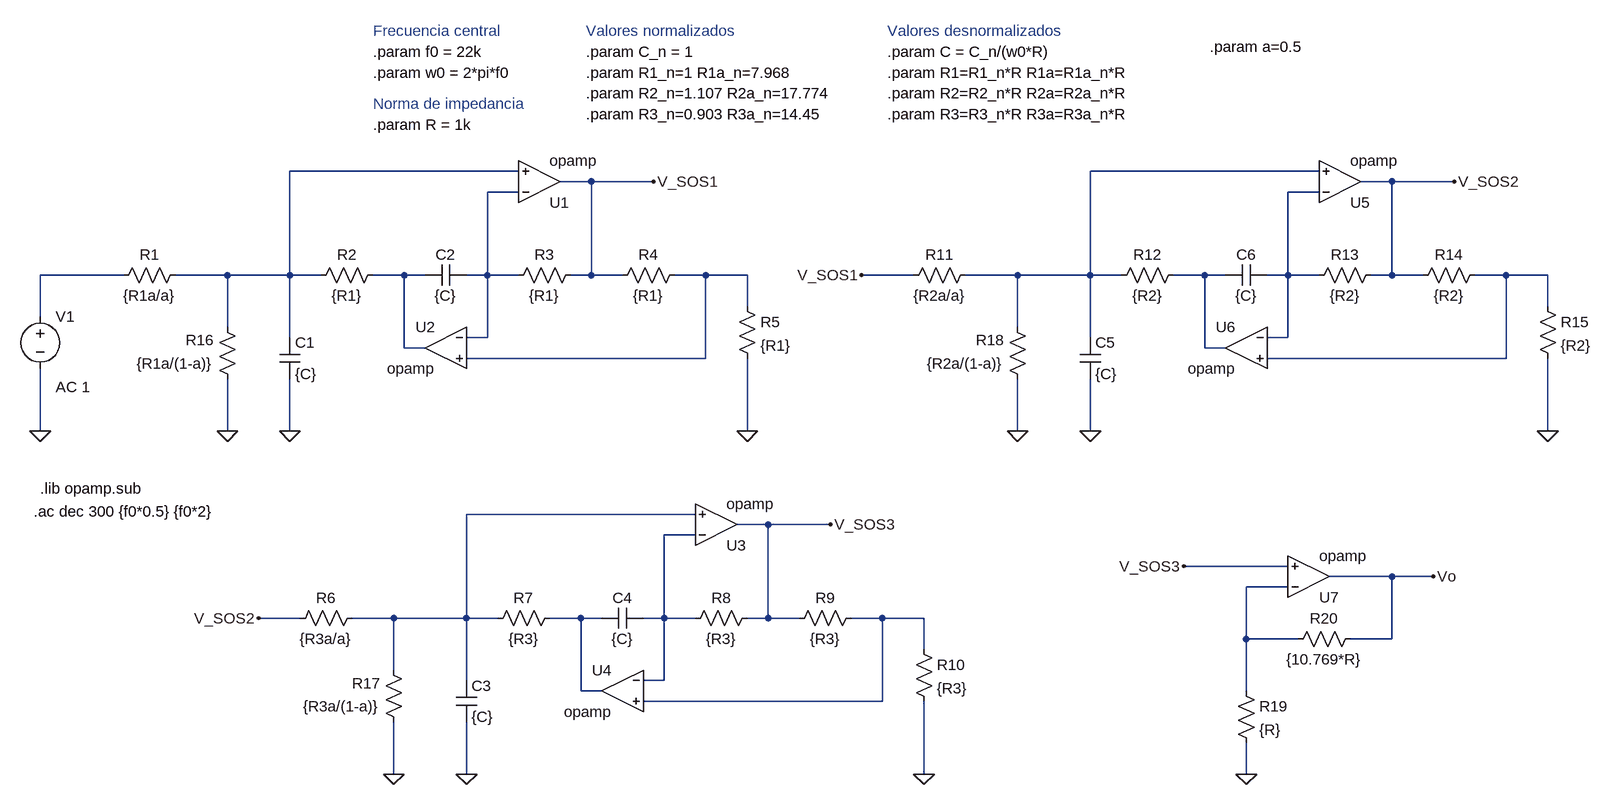
[diagram p0: schematic TS2_Activa.asc]
TS2_Activa.asc, the LTspice schematic file:
Version 4
SHEET 1 2452 1180
WIRE 224 0 -128 0
WIRE 1456 0 1104 0
WIRE 336 16 288 16
WIRE 432 16 336 16
WIRE 1568 16 1520 16
WIRE 1664 16 1568 16
WIRE 224 32 176 32
WIRE 1456 32 1408 32
WIRE -384 160 -512 160
WIRE -224 160 -304 160
WIRE -128 160 -128 0
WIRE -128 160 -224 160
WIRE -80 160 -128 160
WIRE 48 160 0 160
WIRE 80 160 48 160
WIRE 176 160 176 32
WIRE 176 160 144 160
WIRE 224 160 176 160
WIRE 336 160 336 16
WIRE 336 160 304 160
WIRE 384 160 336 160
WIRE 512 160 464 160
WIRE 576 160 512 160
WIRE 832 160 752 160
WIRE 992 160 912 160
WIRE 1104 160 1104 0
WIRE 1104 160 992 160
WIRE 1152 160 1104 160
WIRE 1280 160 1232 160
WIRE 1312 160 1280 160
WIRE 1408 160 1408 32
WIRE 1408 160 1376 160
WIRE 1456 160 1408 160
WIRE 1568 160 1568 16
WIRE 1568 160 1536 160
WIRE 1616 160 1568 160
WIRE 1744 160 1696 160
WIRE 1808 160 1744 160
WIRE 576 208 576 160
WIRE 1808 208 1808 160
WIRE -512 224 -512 160
WIRE -224 240 -224 160
WIRE 992 240 992 160
WIRE -128 256 -128 160
WIRE 176 256 176 160
WIRE 176 256 144 256
WIRE 1104 256 1104 160
WIRE 1408 256 1408 160
WIRE 1408 256 1376 256
WIRE 48 272 48 160
WIRE 80 272 48 272
WIRE 1280 272 1280 160
WIRE 1312 272 1280 272
WIRE 512 288 512 160
WIRE 512 288 144 288
WIRE 1744 288 1744 160
WIRE 1744 288 1376 288
WIRE -512 400 -512 304
WIRE -224 400 -224 320
WIRE -128 400 -128 320
WIRE 576 400 576 288
WIRE 992 400 992 320
WIRE 1104 400 1104 320
WIRE 1808 400 1808 288
WIRE 496 528 144 528
WIRE 608 544 560 544
WIRE 704 544 608 544
WIRE 496 560 448 560
WIRE 1408 608 1248 608
WIRE 1568 624 1472 624
WIRE 1632 624 1568 624
WIRE 1408 640 1344 640
WIRE -112 688 -176 688
WIRE 32 688 -32 688
WIRE 144 688 144 528
WIRE 144 688 32 688
WIRE 192 688 144 688
WIRE 320 688 272 688
WIRE 352 688 320 688
WIRE 448 688 448 560
WIRE 448 688 416 688
WIRE 496 688 448 688
WIRE 608 688 608 544
WIRE 608 688 576 688
WIRE 656 688 608 688
WIRE 784 688 736 688
WIRE 848 688 784 688
WIRE 1344 720 1344 640
WIRE 1424 720 1344 720
WIRE 1568 720 1568 624
WIRE 1568 720 1504 720
WIRE 848 736 848 688
WIRE 32 768 32 688
WIRE 144 784 144 688
WIRE 448 784 448 688
WIRE 448 784 416 784
WIRE 320 800 320 688
WIRE 352 800 320 800
WIRE 1344 800 1344 720
WIRE 784 816 784 688
WIRE 784 816 416 816
WIRE 32 928 32 848
WIRE 144 928 144 848
WIRE 848 928 848 816
WIRE 1344 928 1344 880
FLAG -512 400 0
FLAG 576 400 0
FLAG -128 400 0
FLAG 432 16 V_SOS1
FLAG 848 928 0
FLAG 144 928 0
FLAG 704 544 V_SOS3
FLAG 1808 400 0
FLAG 1104 400 0
FLAG 1664 16 V_SOS2
FLAG 752 160 V_SOS1
FLAG -176 688 V_SOS2
FLAG 32 928 0
FLAG 992 400 0
FLAG -224 400 0
FLAG 1344 928 0
FLAG 1248 608 V_SOS3
FLAG 1632 624 Vo
SYMBOL res -288 144 R90
WINDOW 0 0 56 VBottom 2
WINDOW 3 32 56 VTop 2
SYMATTR InstName R1
SYMATTR Value {R1a/a}
SYMBOL cap -144 256 R0
SYMATTR InstName C1
SYMATTR Value {C}
SYMBOL voltage -512 208 R0
WINDOW 123 24 124 Left 2
WINDOW 39 0 0 Left 0
SYMATTR InstName V1
SYMATTR Value ""
SYMATTR Value2 AC 1
SYMBOL OpAmps\\opamp 256 80 M180
SYMATTR InstName U1
SYMBOL OpAmps\\opamp 112 208 M0
SYMATTR InstName U2
SYMBOL res 16 144 R90
WINDOW 0 0 56 VBottom 2
WINDOW 3 32 56 VTop 2
SYMATTR InstName R2
SYMATTR Value {R1}
SYMBOL cap 144 144 R90
WINDOW 0 0 32 VBottom 2
WINDOW 3 32 32 VTop 2
SYMATTR InstName C2
SYMATTR Value {C}
SYMBOL res 320 144 R90
WINDOW 0 0 56 VBottom 2
WINDOW 3 32 56 VTop 2
SYMATTR InstName R3
SYMATTR Value {R1}
SYMBOL res 480 144 R90
WINDOW 0 0 56 VBottom 2
WINDOW 3 32 56 VTop 2
SYMATTR InstName R4
SYMATTR Value {R1}
SYMBOL res 560 192 R0
SYMATTR InstName R5
SYMATTR Value {R1}
SYMBOL res -16 672 R90
WINDOW 0 0 56 VBottom 2
WINDOW 3 32 56 VTop 2
SYMATTR InstName R6
SYMATTR Value {R3a/a}
SYMBOL cap 128 784 R0
SYMATTR InstName C3
SYMATTR Value {C}
SYMBOL OpAmps\\opamp 528 608 M180
SYMATTR InstName U3
SYMBOL OpAmps\\opamp 384 736 M0
SYMATTR InstName U4
SYMBOL res 288 672 R90
WINDOW 0 0 56 VBottom 2
WINDOW 3 32 56 VTop 2
SYMATTR InstName R7
SYMATTR Value {R3}
SYMBOL cap 416 672 R90
WINDOW 0 0 32 VBottom 2
WINDOW 3 32 32 VTop 2
SYMATTR InstName C4
SYMATTR Value {C}
SYMBOL res 592 672 R90
WINDOW 0 0 56 VBottom 2
WINDOW 3 32 56 VTop 2
SYMATTR InstName R8
SYMATTR Value {R3}
SYMBOL res 752 672 R90
WINDOW 0 0 56 VBottom 2
WINDOW 3 32 56 VTop 2
SYMATTR InstName R9
SYMATTR Value {R3}
SYMBOL res 832 720 R0
SYMATTR InstName R10
SYMATTR Value {R3}
SYMBOL res 928 144 R90
WINDOW 0 0 56 VBottom 2
WINDOW 3 32 56 VTop 2
SYMATTR InstName R11
SYMATTR Value {R2a/a}
SYMBOL cap 1088 256 R0
SYMATTR InstName C5
SYMATTR Value {C}
SYMBOL OpAmps\\opamp 1488 80 M180
SYMATTR InstName U5
SYMBOL OpAmps\\opamp 1344 208 M0
SYMATTR InstName U6
SYMBOL res 1248 144 R90
WINDOW 0 0 56 VBottom 2
WINDOW 3 32 56 VTop 2
SYMATTR InstName R12
SYMATTR Value {R2}
SYMBOL cap 1376 144 R90
WINDOW 0 0 32 VBottom 2
WINDOW 3 32 32 VTop 2
SYMATTR InstName C6
SYMATTR Value {C}
SYMBOL res 1552 144 R90
WINDOW 0 0 56 VBottom 2
WINDOW 3 32 56 VTop 2
SYMATTR InstName R13
SYMATTR Value {R2}
SYMBOL res 1712 144 R90
WINDOW 0 0 56 VBottom 2
WINDOW 3 32 56 VTop 2
SYMATTR InstName R14
SYMATTR Value {R2}
SYMBOL res 1792 192 R0
SYMATTR InstName R15
SYMATTR Value {R2}
SYMBOL res 48 864 R180
WINDOW 0 36 76 Left 2
WINDOW 3 36 40 Left 2
SYMATTR InstName R17
SYMATTR Value {R3a/(1-a)}
SYMBOL res -208 336 R180
WINDOW 0 36 76 Left 2
WINDOW 3 36 40 Left 2
SYMATTR InstName R16
SYMATTR Value {R1a/(1-a)}
SYMBOL res 1008 336 R180
WINDOW 0 36 76 Left 2
WINDOW 3 36 40 Left 2
SYMATTR InstName R18
SYMATTR Value {R2a/(1-a)}
SYMBOL OpAmps\\opamp 1440 688 M180
SYMATTR InstName U7
SYMBOL res 1328 784 R0
SYMATTR InstName R19
SYMATTR Value {R}
SYMBOL res 1520 704 R90
WINDOW 0 0 56 VBottom 2
WINDOW 3 32 56 VTop 2
SYMATTR InstName R20
SYMATTR Value {10.769*R}
TEXT 0 -216 Left 2 ;Frecuencia central
TEXT 0 -184 Left 2 !.param f0 = 22k
TEXT 0 -72 Left 2 !.param R = 1k
TEXT 0 -104 Left 2 ;Norma de impedancia
TEXT 0 -152 Left 2 !.param w0 = 2*pi*f0
TEXT 328 -216 Left 2 ;Valores normalizados
TEXT 328 -184 Left 2 !.param C_n = 1
TEXT 792 -216 Left 2 ;Valores desnormalizados
TEXT 792 -184 Left 2 !.param C = C_n/(w0*R)
TEXT -522 524 Left 2 !.ac dec 300 {f0*0.5} {f0*2}
TEXT 328 -152 Left 2 !.param R1_n=1 R1a_n=7.968
TEXT 328 -120 Left 2 !.param R2_n=1.107 R2a_n=17.774
TEXT 328 -88 Left 2 !.param R3_n=0.903 R3a_n=14.45
TEXT 792 -152 Left 2 !.param R1=R1_n*R R1a=R1a_n*R
TEXT 792 -120 Left 2 !.param R2=R2_n*R R2a=R2a_n*R
TEXT 792 -88 Left 2 !.param R3=R3_n*R R3a=R3a_n*R
TEXT -512 488 Left 2 !.lib opamp.sub
TEXT 1288 -192 Left 2 !.param a=0.5

The netlist it stands for:
* TS2_Activa.asc
R1 N001 N005 {R1a/a}
C1 N001 0 {C}
V1 N005 0 AC 1
XU1 N003 N001 V_SOS1 opamp Aol=100K GBW=10Meg  ; pins invin noninvin out
XU2 N003 N007 N006 opamp Aol=100K GBW=10Meg  ; pins invin noninvin out
R2 N006 N001 {R1}
C2 N003 N006 {C}
R3 V_SOS1 N003 {R1}
R4 N007 V_SOS1 {R1}
R5 N007 0 {R1}
R6 N010 V_SOS2 {R3a/a}
C3 N010 0 {C}
XU3 N011 N010 V_SOS3 opamp Aol=100K GBW=10Meg  ; pins invin noninvin out
XU4 N011 N014 N013 opamp Aol=100K GBW=10Meg  ; pins invin noninvin out
R7 N013 N010 {R3}
C4 N011 N013 {C}
R8 V_SOS3 N011 {R3}
R9 N014 V_SOS3 {R3}
R10 N014 0 {R3}
R11 N002 V_SOS1 {R2a/a}
C5 N002 0 {C}
XU5 N004 N002 V_SOS2 opamp Aol=100K GBW=10Meg  ; pins invin noninvin out
XU6 N004 N009 N008 opamp Aol=100K GBW=10Meg  ; pins invin noninvin out
R12 N008 N002 {R2}
C6 N004 N008 {C}
R13 V_SOS2 N004 {R2}
R14 N009 V_SOS2 {R2}
R15 N009 0 {R2}
R17 0 N010 {R3a/(1-a)}
R16 0 N001 {R1a/(1-a)}
R18 0 N002 {R2a/(1-a)}
XU7 N012 V_SOS3 Vo opamp Aol=100K GBW=10Meg  ; pins invin noninvin out
R19 N012 0 {R}
R20 Vo N012 {10.769*R}
* Frecuencia central
.param f0 = 22k
.param R = 1k
* Norma de impedancia
.param w0 = 2*pi*f0
* Valores normalizados
.param C_n = 1
* Valores desnormalizados
.param C = C_n/(w0*R)
.ac dec 300 {f0*0.5} {f0*2}
.param R1_n=1 R1a_n=7.968
.param R2_n=1.107 R2a_n=17.774
.param R3_n=0.903 R3a_n=14.45
.param R1=R1_n*R R1a=R1a_n*R
.param R2=R2_n*R R2a=R2a_n*R
.param R3=R3_n*R R3a=R3a_n*R
.lib opamp.sub
.param a=0.5
.backanno
.end